# EAGLE schematic Robot Dog Boston V1 (EAGLE 6.1)
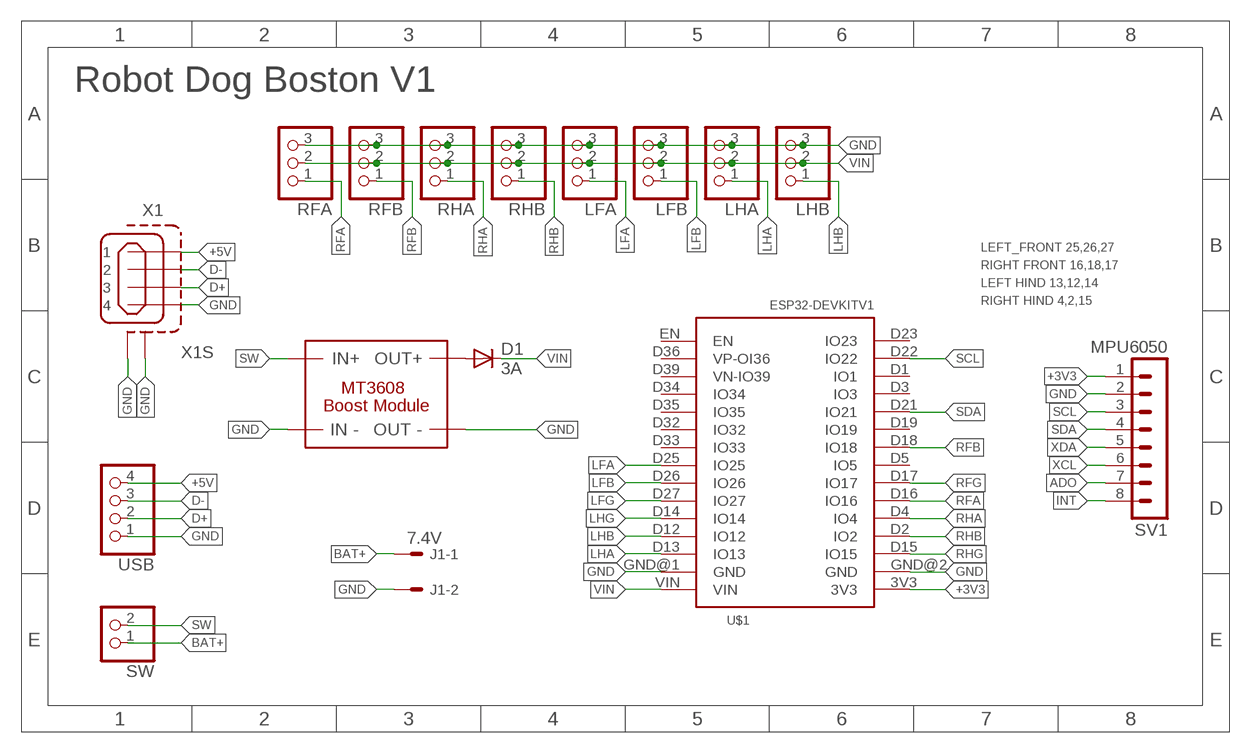
[diagram p0: schematic, sheet 1]

## Parts
D1  3A  1N5060GP  [DO15-12]
J1  7.4V  22-05-7028-02  [7395-02]
LFA  PINHD-1X3  [1X03]
LFB  PINHD-1X3  [1X03]
LHA  PINHD-1X3  [1X03]
LHB  PINHD-1X3  [1X03]
RFA  PINHD-1X3  [1X03]
RFB  PINHD-1X3  [1X03]
RHA  PINHD-1X3  [1X03]
RHB  PINHD-1X3  [1X03]
SV1  MPU6050  MA08-1  [MA08-1]
SW  PINHD-1X2  [1X02]
U$1  ESP32DEVKITV1S  [ESP32-DEVKIT1S]
U$2  REGULATOR_MICRO15.4X9.4  [5V_REGULATOR_BOARD_MICRO_15_4_X_9_4]
USB  PINHD-1X4/90  [1X04/90]
X1  MINI-USB_SHIELD4P-85-32004-00X  [85-32004-00X]

## Nets
+3V3: SV1.1 U$1.3V3
+5V: USB.4 X1.1
ADO: SV1.7
BAT+: J1.1 SW.1
D+: USB.2 X1.3
D-: USB.3 X1.2
GND: J1.2 LFA.3 LFB.3 LHA.3 LHB.3 RFA.3 RFB.3 RHA.3 RHB.3 SV1.2 U$1.GND@1(GND) U$1.GND@2(GND) U$2.IN- U$2.OUT- USB.1 X1.4 X1.M1(S1) X1.M2(S2)
INT: SV1.8
LFA: LFA.1 U$1.D25(IO25)
LFB: LFB.1 U$1.D26(IO26)
LFG: U$1.D27(IO27)
LHA: LHA.1 U$1.D13(IO13)
LHB: LHB.1 U$1.D12(IO12)
LHG: U$1.D14(IO14)
N$1: D1.A U$2.OUT+
RFA: RFA.1 U$1.D16(IO16)
RFB: RFB.1 U$1.D18(IO18)
RFG: U$1.D17(IO17)
RHA: RHA.1 U$1.D4(IO4)
RHB: RHB.1 U$1.D2(IO2)
RHG: U$1.D15(IO15)
SCL: SV1.3 U$1.D22(IO22)
SDA: SV1.4 U$1.D21(IO21)
SW: SW.2 U$2.IN+
VIN: D1.C LFA.2 LFB.2 LHA.2 LHB.2 RFA.2 RFB.2 RHA.2 RHB.2 U$1.VIN
XCL: SV1.6
XDA: SV1.5
Unconnected: U$1.D1(IO1) U$1.D3(IO3) U$1.D5(IO5) U$1.D19(IO19) U$1.D23(IO23) U$1.D32(IO32) U$1.D33(IO33) U$1.D34(IO34) U$1.D35(IO35) U$1.D36(VP-OI36) U$1.D39(VN-IO39) U$1.EN

## Notes on the sheet
- Robot Dog Boston V1
- LEFT_FRONT 25,26,27
- RIGHT FRONT 16,18,17
- LEFT HIND 13,12,14
- RIGHT HIND 4,2,15

## Library data of the parts
D1 = diode:1N5060GP: DIODE controlled avalanche rectifier
J1 = con-molex:22-?-02: CONNECTOR wire to board 2.54 mm (.1 inch) pitch header; OC_FARNELL: 9731601; OC_NEWARK: unknown
LFA LFB LHA LHB RFA RFB RHA RHB = pinhead:PINHD-1X3: PIN HEADER
SV1 = con-lstb:MA08-1: PIN HEADER; OC_FARNELL: unknown; OC_NEWARK: unknown
SW = pinhead:PINHD-1X2: PIN HEADER
U$1 = ESP32-DEVKITV1:ESP32DEVKITV1
U$2 = 8x8x8_cube:REGULATOR_MICRO
USB = pinhead:PINHD-1X4: PIN HEADER
X1 = con-cypressindustries:MINI-USB_SHIELD4P-: MINI USB 4 Pol. Source: www.cypressindustries.com; OC_FARNELL: unknown; OC_NEWARK: unknown